# Altium schematic sheet MMSZ5234BT1G.schdoc
size 124 x 101 mm
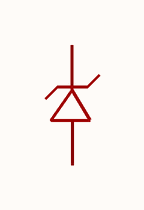
[diagram p0: MMSZ5234BT1G.schdoc]

## Parts
D?  MMSZ5234BT1G  [SOD-123_L2.8-W1.8-LS3.7-RD]  (value not drawn)

## Nets

Not connected (* = marked no-connect by the designer): D? 1(C) 2(A)

## Library data of the parts
D? = MMSZ5234BT1G: Manufacturer: onsemi(安森美); Add into BOM: yes; Diode Configuration: Independent Type; Zener Voltage(Nom): 6.2V; Reverse Leakage Current (Ir): 5uA@4V; Zener Voltage(Range): 5.89V~6.51V; Pd - Power Dissipation(Pd): 500mW; Impedance(Zzt): 7Ω; Symbol: MMSZ5234BT1G; Device: MMSZ5234BT1G; LCSC Part Name: MMSZ5234BT1G; Supplier Part: C194181; Manufacturer Part: MMSZ5234BT1G; Supplier Footprint: SOD-123; JLCPCB Part Class: Extended Part; Datasheet: https://atta.szlcsc.com/upload/public/pdf/source/20221020/24E30AC3B161AD81AE78606E4A7F6AC2.pdf; Supplier: LCSC; Convert to PCB: yes